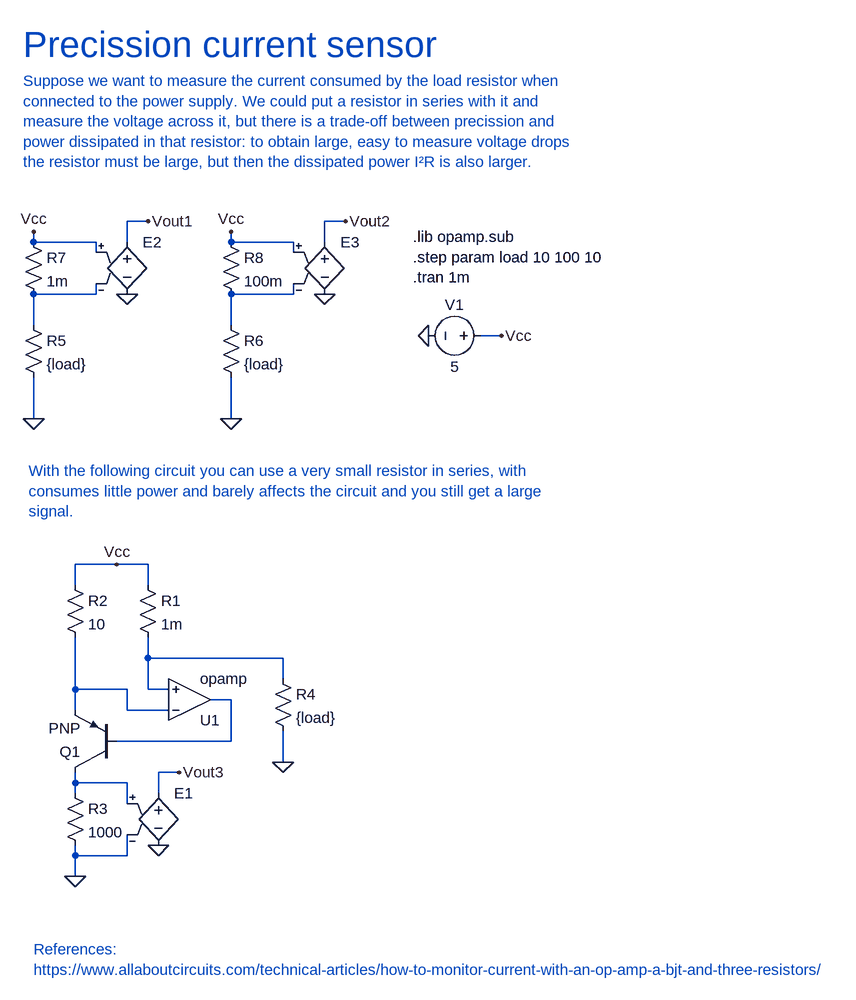
[diagram p0: schematic precission current sensor.asc]
precission current sensor.asc, the LTspice schematic file:
Version 4
SHEET 1 1356 1036
WIRE 144 -128 112 -128
WIRE 448 -128 416 -128
WIRE -32 -96 -32 -112
WIRE 64 -96 -32 -96
WIRE 112 -96 112 -128
WIRE 272 -96 272 -112
WIRE 368 -96 272 -96
WIRE 416 -96 416 -128
WIRE 64 -80 64 -96
WIRE 368 -80 368 -96
WIRE 64 -16 64 -32
WIRE 64 -16 -32 -16
WIRE 368 -16 368 -32
WIRE 368 -16 272 -16
WIRE -32 32 -32 -16
WIRE 272 32 272 -16
WIRE 688 48 656 48
WIRE -32 176 -32 112
WIRE 272 176 272 112
WIRE 96 400 32 400
WIRE 144 400 96 400
WIRE 32 432 32 400
WIRE 144 432 144 400
WIRE 144 544 144 512
WIRE 352 544 144 544
WIRE 352 576 352 544
WIRE 32 592 32 512
WIRE 112 592 32 592
WIRE 144 592 144 544
WIRE 176 592 144 592
WIRE 272 608 240 608
WIRE 32 624 32 592
WIRE 112 624 112 592
WIRE 176 624 112 624
WIRE 272 672 272 608
WIRE 272 672 96 672
WIRE 352 704 352 656
WIRE 192 720 160 720
WIRE 32 736 32 720
WIRE 112 736 32 736
WIRE 32 752 32 736
WIRE 160 752 160 720
WIRE 112 768 112 736
WIRE 32 848 32 832
WIRE 112 848 112 816
WIRE 112 848 32 848
WIRE 32 880 32 848
FLAG 32 880 0
FLAG 576 48 0
FLAG 352 704 0
FLAG 688 48 Vcc
FLAG 96 400 Vcc
FLAG -32 176 0
FLAG 272 176 0
FLAG -32 -112 Vcc
FLAG 272 -112 Vcc
FLAG 160 832 0
FLAG 192 720 Vout3
FLAG 112 -16 0
FLAG 144 -128 Vout1
FLAG 416 -16 0
FLAG 448 -128 Vout2
SYMBOL pnp 96 720 R180
SYMATTR InstName Q1
SYMBOL Opamps\\opamp 208 672 M180
SYMATTR InstName U1
SYMBOL voltage 672 48 R90
WINDOW 0 -32 56 VBottom 2
WINDOW 3 32 56 VTop 2
WINDOW 123 0 0 Left 0
WINDOW 39 0 0 Left 0
SYMATTR InstName V1
SYMATTR Value 5
SYMBOL res 128 416 R0
SYMATTR InstName R1
SYMATTR Value 1m
SYMBOL res 16 416 R0
SYMATTR InstName R2
SYMATTR Value 10
SYMBOL res 16 736 R0
SYMATTR InstName R3
SYMATTR Value 1000
SYMBOL res 336 560 R0
SYMATTR InstName R4
SYMATTR Value {load}
SYMBOL res -48 16 R0
SYMATTR InstName R5
SYMATTR Value {load}
SYMBOL res 256 16 R0
SYMATTR InstName R6
SYMATTR Value {load}
SYMBOL res -48 -112 R0
SYMATTR InstName R7
SYMATTR Value 1m
SYMBOL res 256 -112 R0
SYMATTR InstName R8
SYMATTR Value 100m
SYMBOL e 160 736 R0
WINDOW 3 24 96 Invisible 2
SYMATTR InstName E1
SYMATTR Value 1
SYMBOL e 112 -112 R0
WINDOW 3 29 84 Invisible 2
SYMATTR InstName E2
SYMATTR Value 1
SYMBOL e 416 -112 R0
WINDOW 3 27 86 Invisible 2
SYMATTR InstName E3
SYMATTR Value 1
TEXT 552 -104 Left 2 !.lib opamp.sub\n.step param load 10 100 10\n.tran 1m
TEXT -48 -400 Left 5 ;Precission current sensor
TEXT -48 -344 Left 2 ;Suppose we want to measure the current consumed by the load resistor when\nconnected to the power supply. We could put a resistor in series with it and \nmeasure the voltage across it, but there is a trade-off between precission and\npower dissipated in that resistor: to obtain large, easy to measure voltage drops \nthe resistor must be large, but then the dissipated power I²R is also larger.
TEXT -40 256 Left 2 ;With the following circuit you can use a very small resistor in series, with \nconsumes little power and barely affects the circuit and you still get a large \nsignal.
TEXT -32 992 Left 2 ;References:\nhttps://www.allaboutcircuits.com/technical-articles/how-to-monitor-current-with-an-op-amp-a-bjt-and-three-resistors/

The netlist it stands for:
* precission current sensor.asc
Q1 N006 N005 N004 0 PNP
XU1 N004 N003 N005 opamp Aol=100K GBW=10Meg  ; pins invin noninvin out
V1 Vcc 0 5
R1 Vcc N003 1m
R2 Vcc N004 10
R3 N006 0 1000
R4 N003 0 {load}
R5 N001 0 {load}
R6 N002 0 {load}
R7 Vcc N001 1m
R8 Vcc N002 100m
E1 Vout3 0 N006 0 1
E2 Vout1 0 Vcc N001 1
E3 Vout2 0 Vcc N002 1
.model NPN NPN
.model PNP PNP
.lib standard.bjt
.lib opamp.sub
.step param load 10 100 10
.tran 1m
* Precission current sensor
* Suppose we want to measure the current consumed by the load resistor when
* connected to the power supply. We could put a resistor in series with it and
* measure the voltage across it, but there is a trade-off between precission and
* power dissipated in that resistor: to obtain large, easy to measure voltage drops
* the resistor must be large, but then the dissipated power I²R is also larger.
* With the following circuit you can use a very small resistor in series, with
* consumes little power and barely affects the circuit and you still get a large
* signal.
* References:
* https://www.allaboutcircuits.com/technical-articles/how-to-monitor-current-with-an-op-amp-a-bjt-and-three-resistors/
.backanno
.end